# EAGLE design RawrRacing_EngineKillSwitch (EAGLE 9.6.2)
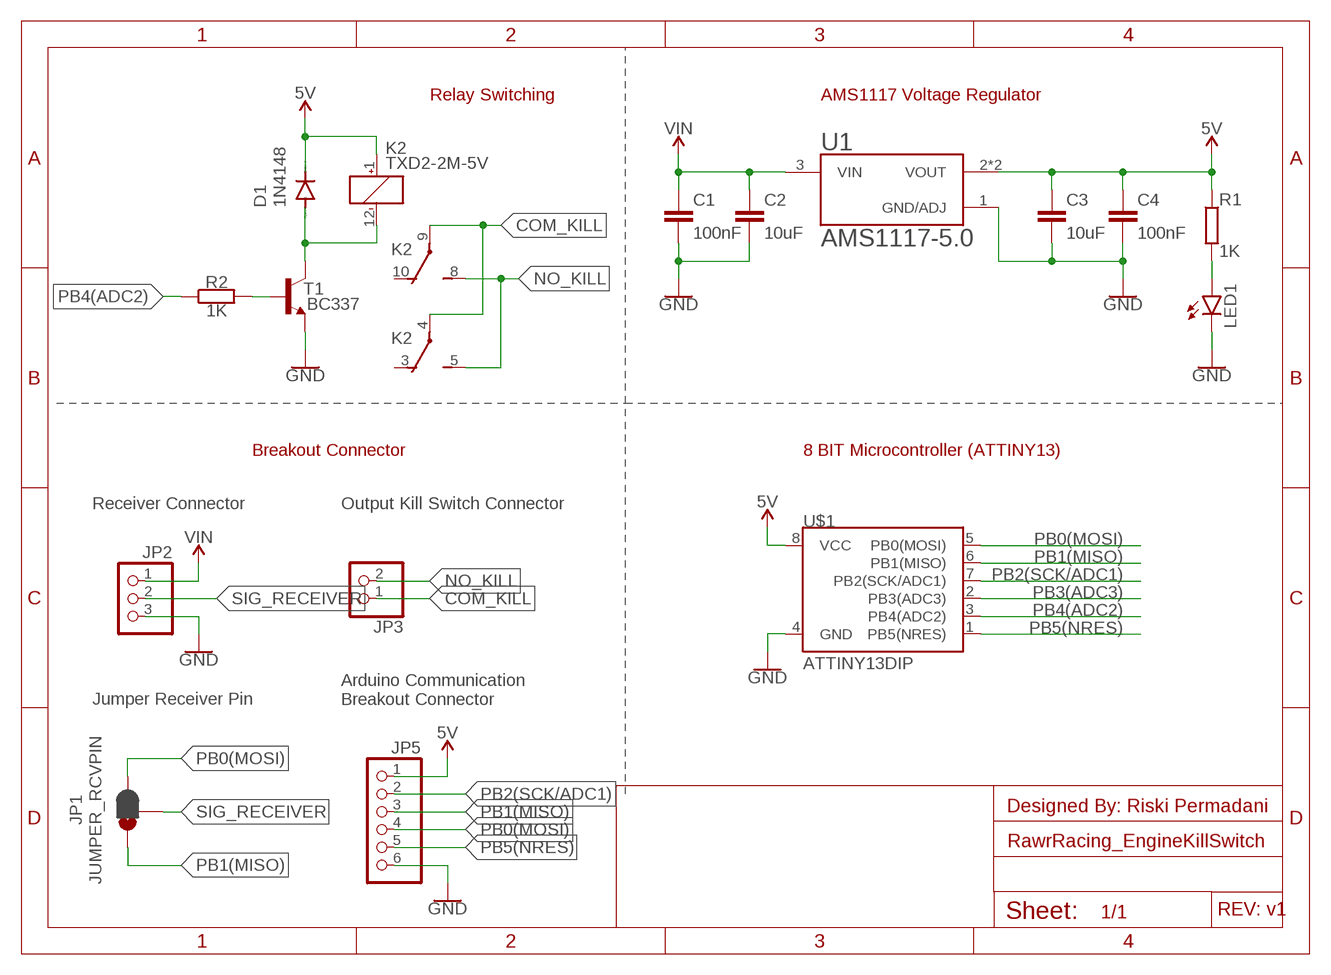
[diagram p0: schematic, sheet 1]
FRAME1 (DINA5_L): DESIGNER: Designed By: Riski Permadani; REVISION: REV: v1

## Parts
C1  100nF  C-EUC0603  [C0603]
C2  10uF  C-EUC0603  [C0603]
C3  10uF  C-EUC0603  [C0603]
C4  100nF  C-EUC0603  [C0603]
D1  1N4148  DIODE-SOD80C  [SOD80C]
JP1  JUMPER_RCVPIN  JUMPER-SMT_3_1-NC_PASTE_SILK  [SMT-JUMPER_3_1-NC_PASTE_SILK]
JP2  PINHD-1X3/90  [1X03/90]
JP3  PINHD-1X2/90  [1X02/90]
JP5  PINHD-1X6  [1X06]
K2  TXD2-2M-5V  [TXD2]
LED1  LEDSML0603  [SML0603]
R1  1K  R-EU_R0603  [R0603]
R2  1K  R-EU_R0603  [R0603]
T1  BC337  [TO92]
U1  AMS1117-5.0  [SOT229P700X180-4N]
U$1  ATTINY13DIP  [DIP08_MCU]

## Nets
5V: C3.1 C4.1 D1.C JP5.1 K2.1(_:+) R1.1 U1.2(VOUT) U1.4(VOUT) U$1.8(VCC)
COM_KILL: JP3.1 K2.4(P) K2.9(P)
GND: C1.2 C2.2 C3.2 C4.2 JP2.3 JP5.6 LED1.C T1.1(E) U1.1(GND/ADJ) U$1.4(GND)
N$1: LED1.A R1.2
N$5: D1.A K2.12(_:-) T1.3(C)
N$6: R2.2 T1.2(B)
NO_KILL: JP3.2 K2.5(S) K2.8(S)
PB0(MOSI): JP1.3 JP5.4 U$1.5(PB0(MOSI))
PB1(MISO): JP1.1 JP5.3 U$1.6(PB1(MISO))
PB2(SCK/ADC1): JP5.2 U$1.7(PB2(SCK/ADC1))
PB3(ADC3): U$1.2(PB3(ADC3))
PB4(ADC2): R2.1 U$1.3(PB4(ADC2))
PB5(NRES): JP5.5 U$1.1(PB5(NRES))
SIG_RECEIVER: JP1.2 JP2.2
VIN: C1.1 C2.1 JP2.1 U1.3(VIN)
Unconnected: K2.3(O) K2.10(O)

## Notes on the sheet
- Relay Switching | AMS1117 Voltage Regulator
- Breakout Connector | 8 BIT Microcontroller (ATTINY13)
- Receiver Connector | Output Kill Switch Connector
- Jumper Receiver Pin
- Arduino Communication
  Breakout Connector

## Library data of the parts
C1-C4 = rcl:C-EU: CAPACITOR, European symbol; SPICEPREFIX: C
D1 = diode:DIODE-: DIODE
JP1 = SparkFun-Jumpers:JUMPER-SMT_3_1-NC_PASTE: Normally closed solder jumper (1 of 2 connections) This jumper has an aperture in the stencil to allow solder paste to bridge one of the two connections. One connection is normally closed (NC), while the other is normally open (NO). Wick off the solder to open the connection. Reapply solder to reclose the connection. Apply solder to the other side instead to change the current path.
JP2 = pinhead:PINHD-1X3: PIN HEADER
JP3 = pinhead:PINHD-1X2: PIN HEADER
JP5 = pinhead:PINHD-1X6: PIN HEADER
K2 = relay:TX?-*: TX Relais NAiS TX-D RELAYS HIGH INSULATION Conforming to the supplementary insulation class of EN Standards (EN41003) Source: http://www.mew-europe.com/.. en_ds_61022_0007.pdf TX-S RELAYS SMALL POLARIZED RELAY WITH HIGH SENSITIVITY 50mW Source: http://www.mew-europe.com/.. en_ds_61022_0022.pdf; OC_FARNELL: unknown; OC_NEWARK: unknown
LED1 = led:LED: LED OSRAM: - CHIPLED LG R971, LG N971, LY N971, LG Q971, LY Q971, LO R971, LY R971 LH N974, LH R974 LS Q976, LO Q976, LY Q976 LO Q996 - Hyper CHIPLED LW Q18S LB Q993, LB Q99A, LB R99A - SideLED LS A670, LO A670, LY A670, LG A670, LP A670 LB A673, LV A673, LT A673, LW A673 LH A674 LY A675 LS A676, LA A676, LO A676, LY A676, LW A676 LS A679, LY A679, LG A679 - Hyper Micro SIDELED® LS Y876, LA Y876, LO Y876, LY Y876 LT Y87S - SmartLED LW L88C, LW L88S LB L89C, LB L89S, LG L890 LS L89K, LO L89K, LY L89K LS L896, LA L896, LO L896, LY L896 - TOPLED LS T670, LO T670, LY T670, LG T670, LP T670 LSG T670, LSP T670, LSY T670, LOP T670, LYG T670 LG T671, LOG T671, LSG T671 LB T673, LV T673, LT T673, LW T673 LH T674 LS T676, LA T676, LO T676, LY T676, LB T676, LH T676, LSB T676, LW T676 LB T67C, LV T67C, LT T67C, LS T67K, LO T67K, LY T67K, LW E67C LS E67B, LA E67B, LO E67B, LY E67B, LB E67C, LV E67C, LT E67C LW T67C LS T679, LY T679, LG T679 LS T770, LO T770, LY T770, LG T770, LP T770 LB T773, LV T773, LT T773, LW T773 LH T774 LS E675, LA E675, LY E675, LS T675 LS T776, LA T776, LO T776, LY T776, LB T776 LHGB T686 LT T68C, LB T68C - Hyper Mini TOPLED® LB M676 - Mini TOPLED Santana® LG M470 LS M47K, LO M47K, LY M47K Source: http://www.osram.convergy.de LUXEON: - LUMILED® LXK2-PW12-R00, LXK2-PW12-S00, LXK2-PW14-U00, LXK2-PW14-V00 LXK2-PM12-R00, LXK2-PM12-S00, LXK2-PM14-U00 LXK2-PE12-Q00, LXK2-PE12-R00, LXK2-PE12-S00, LXK2-PE14-T00, LXK2-PE14-U00 LXK2-PB12-K00, LXK2-PB12-L00, LXK2-PB12-M00, LXK2-PB14-N00, LXK2-PB14-P00, LXK2-PB14-Q00 LXK2-PR12-L00, LXK2-PR12-M00, LXK2-PR14-Q00, LXK2-PR14-R00 LXK2-PD12-Q00, LXK2-PD12-R00, LXK2-PD12-S00 LXK2-PH12-R00, LXK2-PH12-S00 LXK2-PL12-P00, LXK2-PL12-Q00, LXK2-PL12-R00 Source: www.luxeon.com KINGBRIGHT: KA-3528ASYC Source: www.kingbright.com
R1 R2 = rcl:R-EU_: RESISTOR, European symbol; SPICEPREFIX: R
T1 = transistor:BC337: NPN TRANSISTOR
U1 = AMS1117-5.0:AMS1117-5.0: Check availability <https://pricing.snapeda.com/parts/AMS1117-5.0/Advanced%20Monolithic%20Systems/view-part?ref=eda>; AVAILABILITY: Not in stock; CHECK_PRICES: https://www.snapeda.com/parts/AMS1117-5.0/Advanced+Monolithic+Systems/view-part/?ref=eda; DESCRIPTION: Sot223/Pkg 1-Amp 5-Volt Low Drop Out Voltage Regulatator; MF: Advanced Monolithic Systems; MP: AMS1117-5.0; PACKAGE: SOT-223 Seeed Technology; PRICE: None; SNAPEDA_LINK: https://www.snapeda.com/parts/AMS1117-5.0/Advanced+Monolithic+Systems/view-part/?ref=snap
U$1 = SparkFun-Retired:ATTINY13: ATTINY13 Retired

## Board
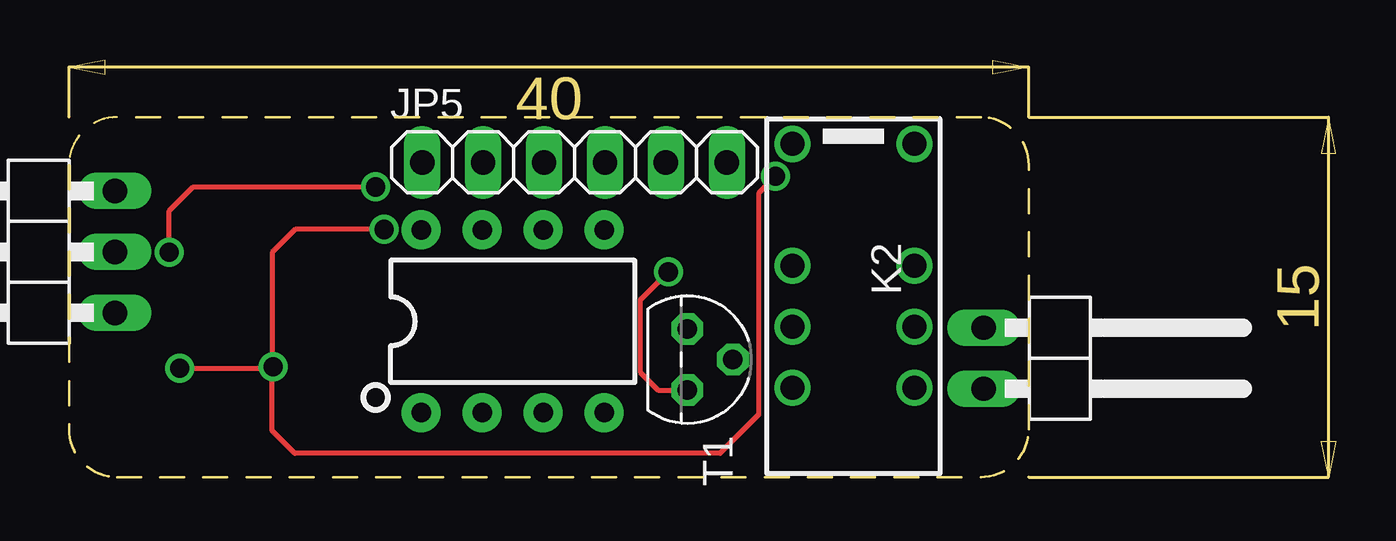
[diagram p1: board, top side]
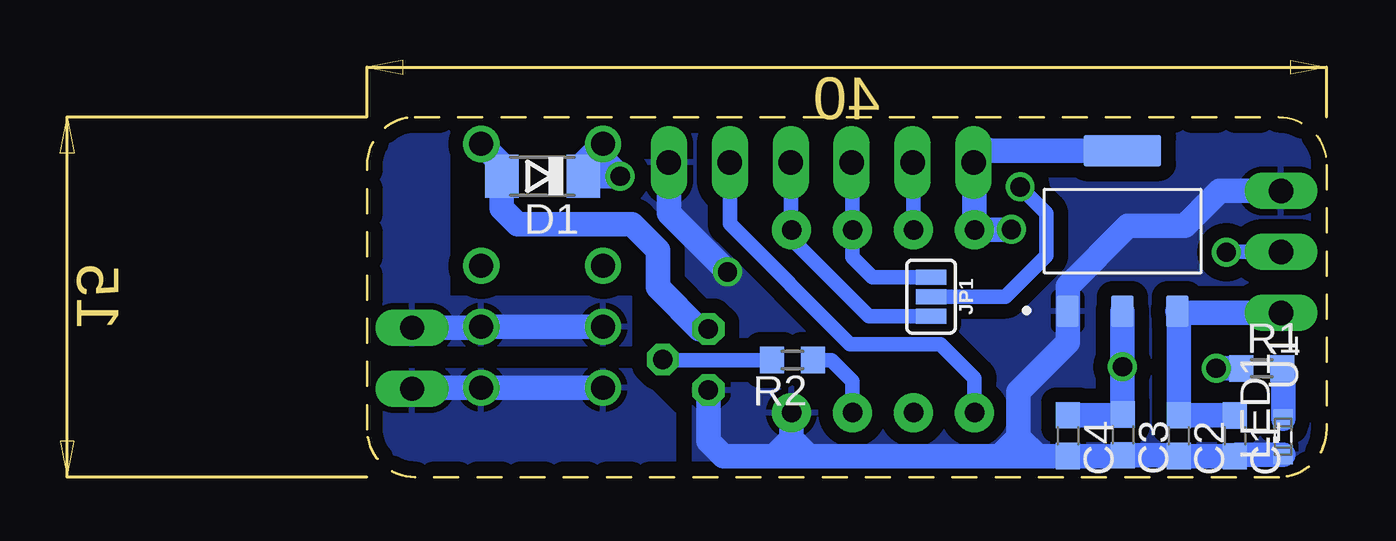
[diagram p2: board, bottom side, seen from below]

Size 40 x 15 mm. Coordinates in mm from the lower left corner, seen from the top.
Outline: 2,0 38,0 arc90 40,2 40,13 arc90 38,15 2,15 arc90 0,13 0,2 arc90 2,0
Copper layers (1*16): Top 0.035mm / dielectric 1.5mm / Bottom 0.035mm
Design rules "default *": minimum track width 6mil, minimum drill 0.35mm, track to track 6mil, track to pad 6mil, pad to pad 6mil, via to via 6mil, smd to smd 6mil, copper to edge 10mil, drill to drill 10mil, minimum pad ring 10mil, minimum via ring 8mil, stop-mask expansion 4mil, vias tented up to drill 0mil, thermal gap 10mil

### Footprints (pad centres in the part's own frame; a part is rotated, then mirrored left to right if it is on the bottom)
C0603 = smd 1.1 x 1: 1 -0.85,0; 2 0.85,0
SOD80C = smd 1.4 x 1.8: A 1.7,0; C -1.7,0
SMT-JUMPER_3_1-NC_PASTE_SILK = smd 0.635 x 1.27: 1 -0.813,0; 2 0,0; 3 0.813,0
1X03/90 = drill 1.016 long: 1 -2.54,-3.81; 2 0,-3.81; 3 2.54,-3.81
1X02/90 = drill 1.016 long: 1 -1.27,-3.81; 2 1.27,-3.81
1X06 = drill 1.016 long: 1 -6.35,0; 2 -3.81,0; 3 -1.27,0; 4 1.27,0; 5 3.81,0; 6 6.35,0
TXD2 = drill 1: 1 -6.35,-2.54; 3 -1.27,-2.54; 4 1.27,-2.54; 5 3.81,-2.54; 8 3.81,2.54; 9 1.27,2.54; 10 -1.27,2.54; 12 -6.35,2.54
SML0603 = smd 0.8 x 0.8: A 0.75,0; C -0.75,0
R0603 = smd 1 x 1.1: 1 -0.85,0; 2 0.85,0
TO92 = drill 0.813 octagon: 1 1.27,0; 2 0,1.905; 3 -1.27,0
SOT229P700X180-4N = smd 0.93 x 1.31: 1 -2.29,-3.345; 2 0,-3.345; 3 2.29,-3.345 | smd 3.24 x 1.31: 4 0,3.345
DIP08_MCU = drill 0.813 pad 1.626: 1 -3.81,-3.81; 2 -1.27,-3.81; 3 1.27,-3.81; 4 3.81,-3.81; 5 3.81,3.81; 6 1.27,3.81; 7 -1.27,3.81; 8 -3.81,3.81

### Placement (x,y rotation side)
C1  3.83,1.72 270 bottom
C2  6.17,1.73 270 bottom
C3  8.5,1.76 270 bottom
C4  10.78,1.73 270 bottom
D1  32.69,12.54 180 bottom
JP1  16.49,7.52 270 bottom
JP2  -1.9,9.38 90 top
JP3  41.93,4.95 270 top
JP5  21.07,13.11 0 top
K2  32.7,7.53 270 top
LED1  1.82,1.68 90 bottom
R1  2.71,4.53 0 bottom
R2  22.27,4.88 180 bottom
T1  25.77,4.9 270 top
U1  8.51,10.25 0 bottom
U$1  18.49,6.49 0 top

### Tracks (layer width: path | path; a pad name or v marks a point on that pad's centre or on a via)
5V  (via drill 0.8)
  Top 0.203: v29.45,12.53 28.74,11.82 28.74,2.59 27.14,0.99 9.41,0.99 8.47,1.93 8.47,4.55 | 8.47,4.55 8.47,4.56 | 8.47,4.56 v8.51,4.6 | v4.61,4.54 8.46,4.54 8.47,4.55 | v13.14,10.32 9.43,10.32 8.47,9.36 8.47,4.56
  Bottom 1.016: 14.69,13.08 U$1.8 13.16,10.3 v13.14,10.32 | 14.69,13.08 JP5.1 | 14.69,13.08 14.12,13.63 14.09,13.6 U1.4 | C4.1 8.53,2.58 C3.1 v8.51,4.6 U1.2 | v4.61,4.54 v4.6,4.53 R1.1 | v29.45,12.54 D1.C 30.99,13.05 K2.1 30.16,13.24 v29.45,12.54 | v29.45,12.54 v29.45,12.53
COM_KILL
  Bottom 1.016: JP3.1 35.28,6.22 K2.9 K2.4
  pour Bottom (isolate 0.61): 29,5.5 40.09,5.5 40.09,7.62 40.09,15.1 36.88,15.1 36.58,15.1 36.58,9.34 36.58,7.52 34.35,7.52 29,7.52
GND  (via drill 0.8)
  Top 0.203: T1.1 24.56,3.63 23.81,4.38 23.81,7.38 v24.98,8.55
  Bottom 0.203: 23.81,0.92 23.76,0.87 23.04,0.87
  Bottom 1.016: 1.91,11.8 JP2.3 4.47,11.92 5.92,10.47 8.29,10.47 10.8,7.96 U1.1 10.8,5.61 12.85,3.56 12.85,1.67 | 13.65,0.87 12.72,0.87 | 12.72,0.87 12.05,0.87 | 12.05,0.87 C4.2 8.53,0.88 C3.2 6.2,0.91 C2.2 C1.2 3.77,0.93 LED1.C | 12.85,1.67 12.85,1 12.72,0.87 | 12.85,1.67 12.05,0.87 | 13.65,0.87 12.85,1.67 | 22.36,2.74 U$1.4 22.3,1.54 | T1.1 25.77,1.49 25.15,0.87 23.04,0.87 | 13.65,0.87 21.58,0.87 | 21.58,0.87 22.2,0.87 | 22.2,0.87 23.04,0.87 | 22.2,0.87 22.3,0.97 22.3,1.54 | 23.04,0.87 22.37,1.54 22.3,1.54 | 22.3,1.54 22.25,1.54 21.58,0.87 | v24.98,8.55 27.42,10.99 JP5.6
  pour Bottom (isolate 0.61): 0,0 26.41,0 26.41,3.55 26.41,7.64 33.57,14.8 33.78,15.01 0,15.01
N$1
  Bottom 1.016: LED1.A 1.82,4.49 R1.2
N$5
  Bottom 1.016: K2.12 34.39,13.03 D1.A 34.39,11.21 33.72,10.54 28.96,10.54 27.88,9.46 27.88,7.91 26.14,6.17 T1.3
N$6
  Bottom 0.61: R2.2 27.66,4.88 T1.2
NO_KILL
  Bottom 1.016: K2.5 K2.8 38.08,3.72 JP3.2
  pour Bottom (isolate 0.61): 29,4.5 40.05,4.5 40.05,0.21 40.05,-0.05 36.65,-0.05 27.17,-0.05 27.17,0.75 27.17,2.67
PB0(MOSI)
  Bottom 0.61: JP5.4 22.34,10.34 | 22.34,10.34 U$1.5 | JP1.3 19.09,6.71 22.34,9.96 22.34,10.34
PB1(MISO)
  Bottom 0.61: JP5.3 19.77,13.08 U$1.6 19.77,9.16 18.93,8.33 JP1.1
PB2(SCK/ADC1)
  Bottom 0.61: U$1.7 17.23,13.08 JP5.2
PB4(ADC2)
  Bottom 0.61: U$1.3 19.77,4 20.64,4.88 R2.1
PB5(NRES)
  Bottom 0.61: U$1.1 14.69,4.12 16.11,5.54 19.87,5.54 24.88,10.55 JP5.5
SIG_RECEIVER  (via drill 0.8)
  Top 0.203: v4.18,9.37 4.18,11.09 5.18,12.09 v12.78,12.09
  Bottom 0.61: JP2.2 4.17,9.38 v4.18,9.37 | JP1.2 13.39,7.52 11.69,9.22 11.69,11 v12.78,12.09
VIN
  Bottom 1.016: C1.1 C2.1 6.16,6.84 U1.3 6.16,6.84 JP2.1